# Altium schematic sheet Connectors.SchDoc
size A4
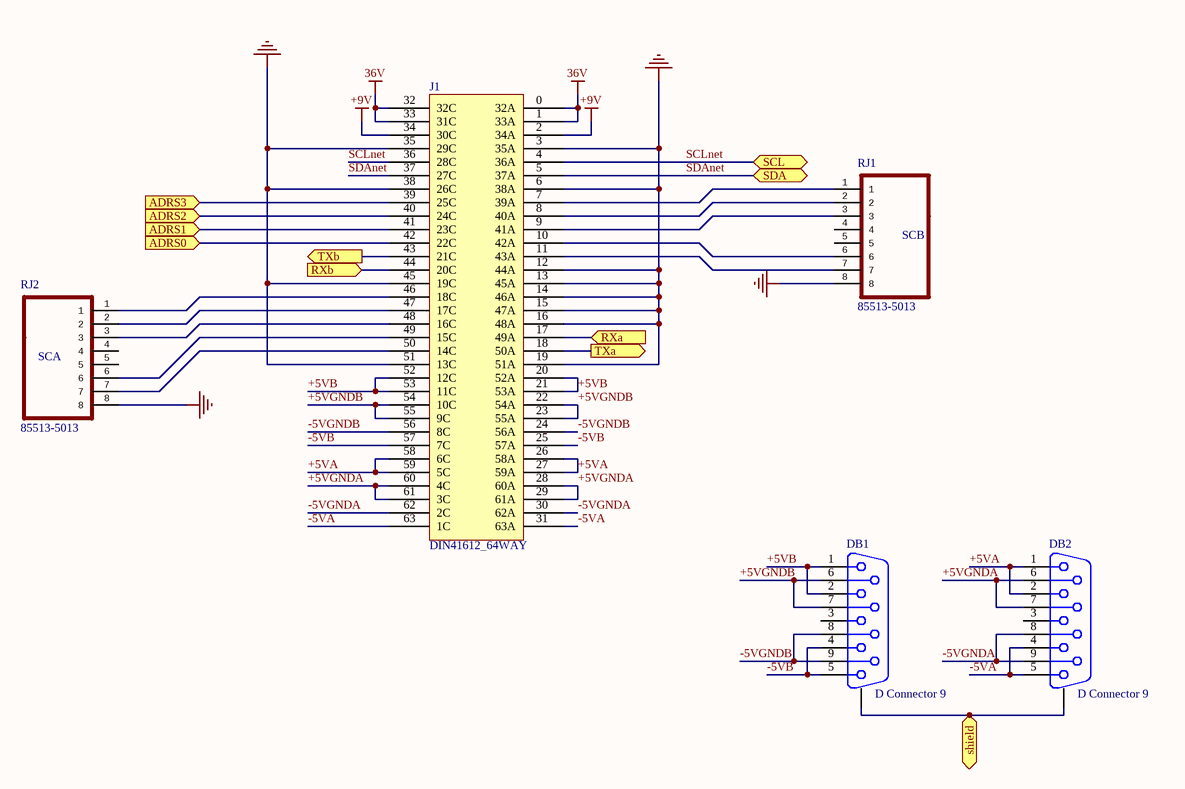
[diagram p0: Connectors.SchDoc]

## Parts
DB1  D Connector 9  [DSUB1.STRAIGHT]
DB2  D Connector 9  [DSUB1.STRAIGHT]
J1  DIN41612_64WAY  [09 03 164 6919]
RJ1  85513-5013  [RJ45_SMD_VERT]
RJ2  85513-5013  [RJ45_SMD_VERT]

## Ports
ADRS0 (in), ADRS1 (in), ADRS2 (in), ADRS3 (in), RXa (in), RXb (in), SCL (bidir), SDA (bidir), shield (in), TXa (out), TXb (out)

## Nets
36V: J1.0(32A) J1.1(33A) J1.32(32C) J1.33(31C)
+9V: J1.2(34A) J1.34(30C)
GND: J1.3(35A) J1.6(38A) J1.12(44A) J1.13(45A) J1.14(46A) J1.15(47A) J1.16(48A) J1.19(51A) J1.35(29C) J1.38(26C) J1.45(19C) J1.51(13C) RJ1.8 RJ2.8
+5VA: DB2.1 DB2.2 J1.26(58A) J1.27(59A) J1.58(6C) J1.59(5C)
+5VB: DB1.1 DB1.2 J1.20(52A) J1.21(53A) J1.52(12C) J1.53(11C)
+5VGNDA: DB2.6 DB2.7 J1.28(60A) J1.29(61A) J1.60(4C) J1.61(3C)
+5VGNDB: DB1.6 DB1.7 J1.22(54A) J1.23(55A) J1.54(10C) J1.55(9C)
-5VA: DB2.4 DB2.5 J1.31(63A) J1.63(1C)
-5VB: DB1.4 DB1.5 J1.25(57A) J1.57(7C)
-5VGNDA: DB2.8 DB2.9 J1.30(62A) J1.62(2C)
-5VGNDB: DB1.8 DB1.9 J1.24(56A) J1.56(8C)
ADRS0: J1.42(22C) ; port ADRS0
ADRS1: J1.41(23C) ; port ADRS1
ADRS2: J1.40(24C) ; port ADRS2
ADRS3: J1.39(25C) ; port ADRS3
RXa: J1.17(49A) ; port RXa
RXb: J1.44(20C) ; port RXb
SCLnet: J1.4(36A) J1.36(28C) ; port SCL
SDAnet: J1.5(37A) J1.37(27C) ; port SDA
shield: DB1.0 DB2.0 ; port shield
TXa: J1.18(50A) ; port TXa
TXb: J1.43(21C) ; port TXb
NetJ1_7: J1.7(39A) RJ1.1
NetJ1_8: J1.8(40A) RJ1.2
NetJ1_9: J1.9(41A) RJ1.3
NetJ1_10: J1.10(42A) RJ1.6
NetJ1_11: J1.11(43A) RJ1.7
NetJ1_46: J1.46(18C) RJ2.1
NetJ1_47: J1.47(17C) RJ2.2
NetJ1_48: J1.48(16C) RJ2.3
NetJ1_49: J1.49(15C) RJ2.6
NetJ1_50: J1.50(14C) RJ2.7

Not connected (* = marked no-connect by the designer): DB1 3; DB2 3; RJ1 4 5; RJ2 4 5

## Notes on the sheet
- (near RJ1) SCB
- (near RJ2) SCA

## Library data of the parts
DB1 DB2 = D Connector 9: Receptacle Assembly, 9 Position, Right Angle; PartNo: L177TSEH09SOL2RM8; PackageDocument: O; Positions: 9; Published: 15-Jun-2001; LatestRevisionDate: 17-Jul-2002; LatestRevisionNote: Re-released for DXP Platform.; DatasheetDocument: 1-Sep-1999; PackageReference: 788750; Publisher: Altium Limited; Orientation: Right Angle; Gender: Receptacle
J1 = DIN41612_64WAY: PartNo: 9-1393640-3
RJ1 RJ2 = 85513-5013: MPN: 85513-5013; PACKAGE: RJ45, JACK, 8P8C; SUPPLIER: MOLEX; PartNo: 85513-5013